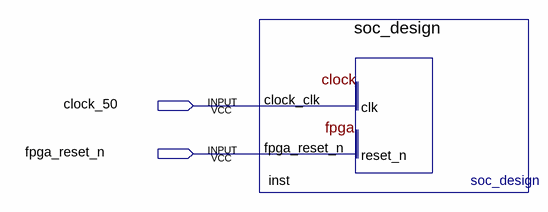
[diagram p0: schematic sheet]
// Quartus schematic chris_proj.bdf as structural Verilog: 1 symbols, 2 pins
module chris_proj (
  input  clock_50,
  input  fpga_reset_n
);

  soc_design inst (.clock_clk(clock_50), .fpga_reset_n(fpga_reset_n));
endmodule
